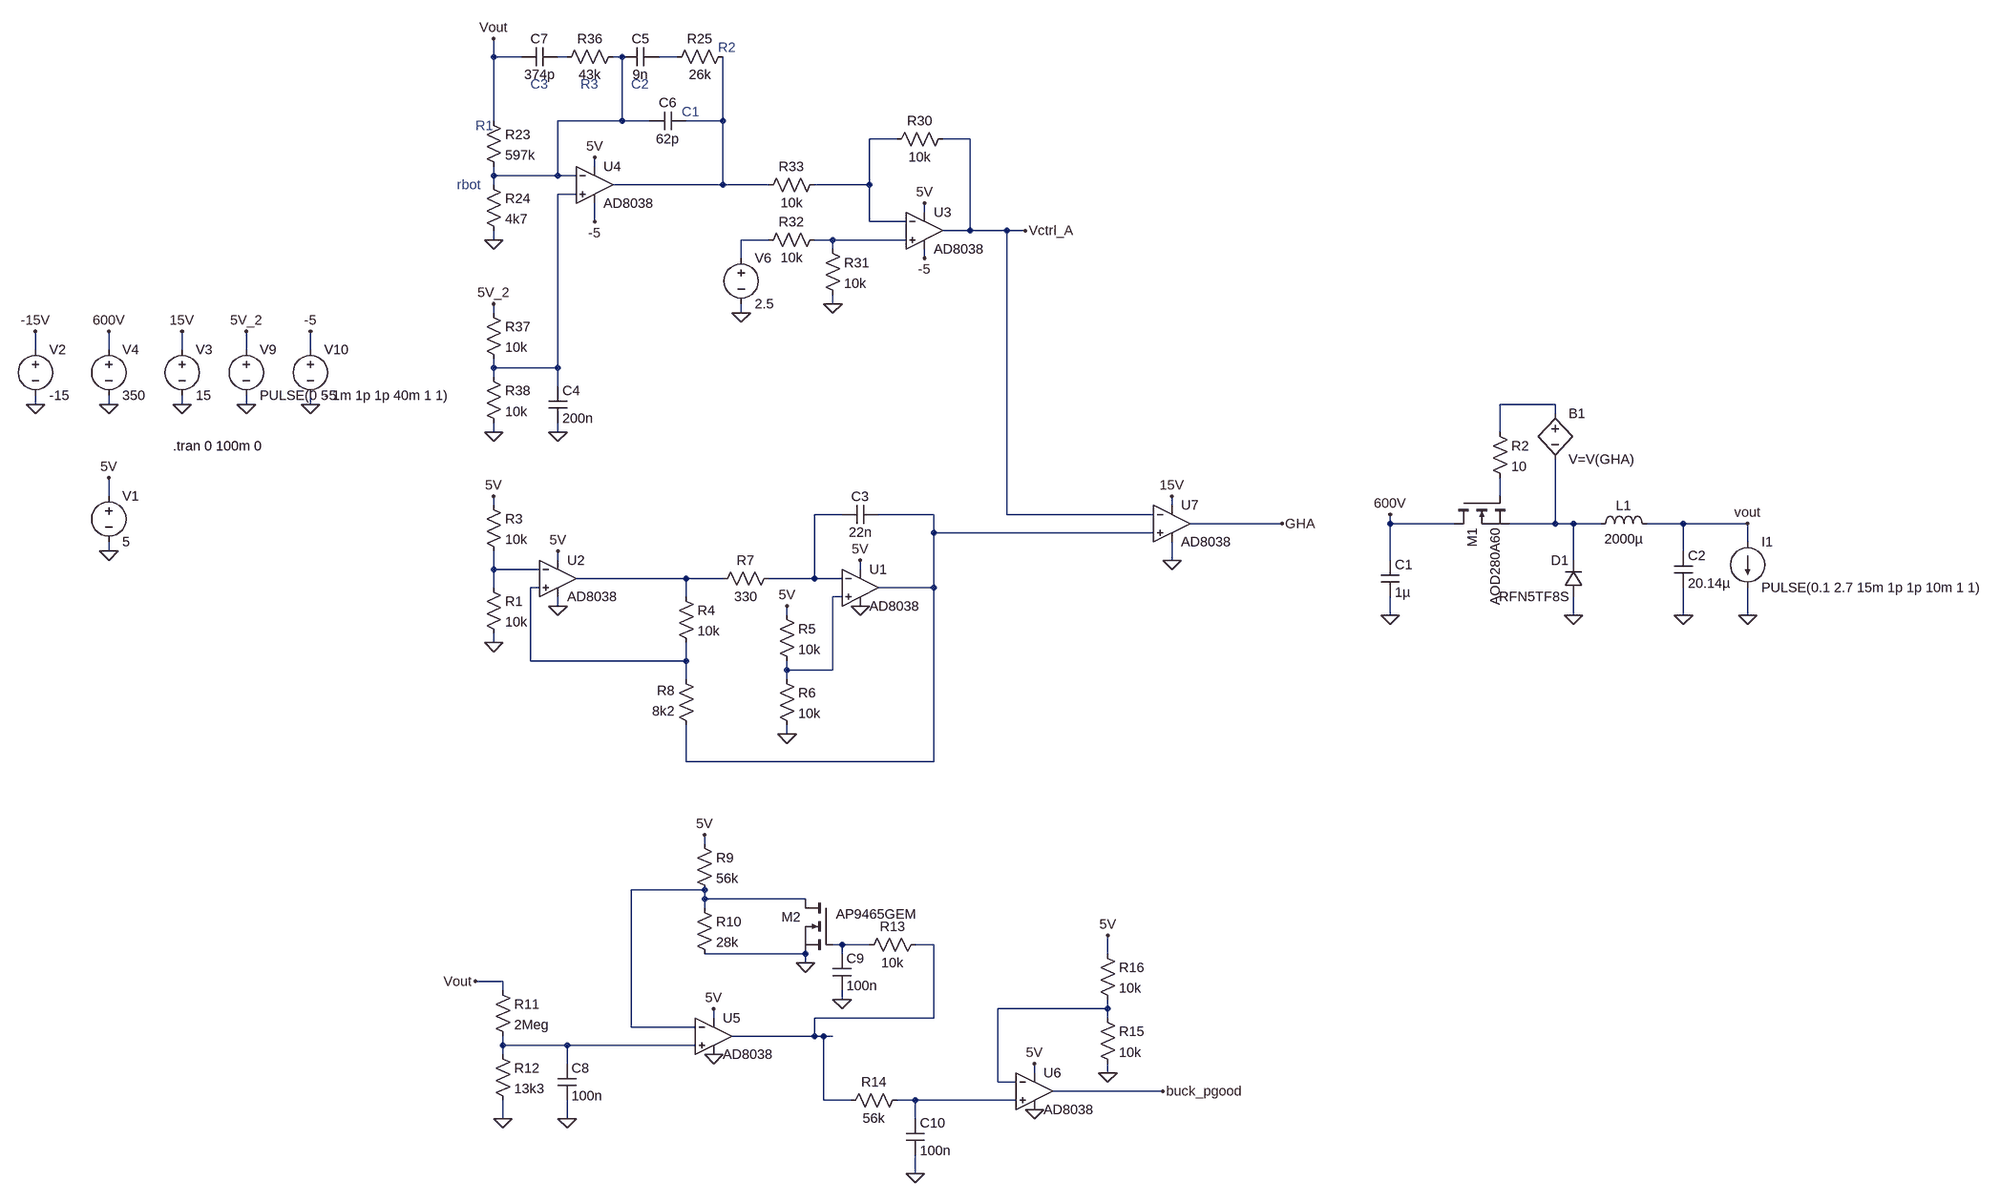
[diagram p0: schematic vicor_buck.asc]
vicor_buck.asc, the LTspice schematic file:
Version 4.1
SHEET 1 4056 680
WIRE -2176 -2112 -2176 -2144
WIRE -2128 -2112 -2176 -2112
WIRE -2048 -2112 -2064 -2112
WIRE -1952 -2112 -1968 -2112
WIRE -1856 -2112 -1888 -2112
WIRE -2176 -2000 -2176 -2112
WIRE -1952 -2000 -1952 -2112
WIRE -1952 -2000 -2064 -2000
WIRE -1904 -2000 -1952 -2000
WIRE -1776 -2000 -1776 -2112
WIRE -1776 -2000 -1840 -2000
WIRE -1472 -1968 -1520 -1968
WIRE -1344 -1968 -1392 -1968
WIRE -2000 -1920 -2000 -1936
WIRE -2176 -1904 -2176 -1920
WIRE -2064 -1904 -2064 -2000
WIRE -2064 -1904 -2176 -1904
WIRE -2032 -1904 -2064 -1904
WIRE -2176 -1888 -2176 -1904
WIRE -1776 -1888 -1776 -2000
WIRE -1776 -1888 -1968 -1888
WIRE -1696 -1888 -1776 -1888
WIRE -1520 -1888 -1520 -1968
WIRE -1520 -1888 -1616 -1888
WIRE -2032 -1872 -2064 -1872
WIRE -1424 -1840 -1424 -1856
WIRE -2000 -1824 -2000 -1856
WIRE -1520 -1824 -1520 -1888
WIRE -1456 -1824 -1520 -1824
WIRE -1344 -1808 -1344 -1968
WIRE -1344 -1808 -1392 -1808
WIRE -1280 -1808 -1344 -1808
WIRE -1248 -1808 -1280 -1808
WIRE -2176 -1792 -2176 -1808
WIRE -1696 -1792 -1744 -1792
WIRE -1584 -1792 -1616 -1792
WIRE -1456 -1792 -1584 -1792
WIRE -1584 -1776 -1584 -1792
WIRE -1744 -1760 -1744 -1792
WIRE -1424 -1760 -1424 -1776
WIRE -1584 -1680 -1584 -1696
WIRE -2176 -1664 -2176 -1680
WIRE -1744 -1664 -1744 -1680
WIRE -2976 -1600 -2976 -1632
WIRE -2848 -1600 -2848 -1632
WIRE -2720 -1600 -2720 -1632
WIRE -2608 -1600 -2608 -1632
WIRE -2496 -1600 -2496 -1632
WIRE -2176 -1568 -2176 -1584
WIRE -2064 -1568 -2064 -1872
WIRE -2064 -1568 -2176 -1568
WIRE -2176 -1552 -2176 -1568
WIRE -2064 -1536 -2064 -1568
WIRE -2976 -1504 -2976 -1520
WIRE -2848 -1504 -2848 -1520
WIRE -2720 -1504 -2720 -1520
WIRE -2608 -1504 -2608 -1520
WIRE -2496 -1504 -2496 -1520
WIRE -288 -1504 -384 -1504
WIRE -288 -1488 -288 -1504
WIRE -2176 -1456 -2176 -1472
WIRE -2064 -1456 -2064 -1472
WIRE -384 -1456 -384 -1504
WIRE -2848 -1344 -2848 -1376
WIRE -384 -1344 -384 -1376
WIRE -2176 -1328 -2176 -1344
WIRE -992 -1328 -992 -1344
WIRE -1568 -1312 -1616 -1312
WIRE -1408 -1312 -1504 -1312
WIRE -1280 -1312 -1280 -1808
WIRE -1024 -1312 -1280 -1312
WIRE -800 -1296 -960 -1296
WIRE -576 -1296 -576 -1312
WIRE -464 -1296 -576 -1296
WIRE -288 -1296 -288 -1408
WIRE -288 -1296 -368 -1296
WIRE -256 -1296 -288 -1296
WIRE -208 -1296 -256 -1296
WIRE -64 -1296 -128 -1296
WIRE 48 -1296 -64 -1296
WIRE -1408 -1280 -1408 -1312
WIRE -1024 -1280 -1408 -1280
WIRE 48 -1264 48 -1296
WIRE -2848 -1248 -2848 -1264
WIRE -64 -1248 -64 -1296
WIRE -2064 -1232 -2064 -1248
WIRE -992 -1232 -992 -1264
WIRE -576 -1232 -576 -1296
WIRE -256 -1232 -256 -1296
WIRE -2176 -1216 -2176 -1248
WIRE -2096 -1216 -2176 -1216
WIRE -1536 -1216 -1536 -1232
WIRE -1840 -1200 -2032 -1200
WIRE -1776 -1200 -1840 -1200
WIRE -1616 -1200 -1616 -1312
WIRE -1616 -1200 -1696 -1200
WIRE -1568 -1200 -1616 -1200
WIRE -2176 -1184 -2176 -1216
WIRE -2096 -1184 -2112 -1184
WIRE -1408 -1184 -1408 -1280
WIRE -1408 -1184 -1504 -1184
WIRE -1840 -1168 -1840 -1200
WIRE -1568 -1168 -1584 -1168
WIRE -2064 -1152 -2064 -1168
WIRE -1664 -1136 -1664 -1152
WIRE -576 -1136 -576 -1168
WIRE -256 -1136 -256 -1168
WIRE -64 -1136 -64 -1184
WIRE 48 -1136 48 -1184
WIRE -2176 -1088 -2176 -1104
WIRE -2112 -1056 -2112 -1184
WIRE -1840 -1056 -1840 -1088
WIRE -1840 -1056 -2112 -1056
WIRE -1664 -1040 -1664 -1056
WIRE -1584 -1040 -1584 -1168
WIRE -1584 -1040 -1664 -1040
WIRE -1840 -1024 -1840 -1056
WIRE -1664 -1024 -1664 -1040
WIRE -1664 -928 -1664 -944
WIRE -1840 -880 -1840 -944
WIRE -1408 -880 -1408 -1184
WIRE -1408 -880 -1840 -880
WIRE -1808 -736 -1808 -752
WIRE -1808 -656 -1936 -656
WIRE -1808 -640 -1808 -656
WIRE -1632 -640 -1808 -640
WIRE -1808 -624 -1808 -640
WIRE -1568 -560 -1584 -560
WIRE -1520 -560 -1568 -560
WIRE -1408 -560 -1440 -560
WIRE -1632 -544 -1808 -544
WIRE -1568 -544 -1568 -560
WIRE -1104 -544 -1104 -576
WIRE -1632 -528 -1632 -544
WIRE -2160 -496 -2208 -496
WIRE -2160 -480 -2160 -496
WIRE -1568 -464 -1568 -480
WIRE -1104 -448 -1104 -464
WIRE -1104 -448 -1296 -448
WIRE -1792 -432 -1792 -448
WIRE -1408 -432 -1408 -560
WIRE -1408 -432 -1616 -432
WIRE -1104 -432 -1104 -448
WIRE -1936 -416 -1936 -656
WIRE -1824 -416 -1936 -416
WIRE -1616 -400 -1616 -432
WIRE -1616 -400 -1760 -400
WIRE -1600 -400 -1616 -400
WIRE -1584 -400 -1600 -400
WIRE -2160 -384 -2160 -400
WIRE -2048 -384 -2160 -384
WIRE -1824 -384 -2048 -384
WIRE -2160 -368 -2160 -384
WIRE -2048 -352 -2048 -384
WIRE -1232 -336 -1232 -352
WIRE -1104 -336 -1104 -352
WIRE -1296 -320 -1296 -448
WIRE -1264 -320 -1296 -320
WIRE -1008 -304 -1200 -304
WIRE -1600 -288 -1600 -400
WIRE -1552 -288 -1600 -288
WIRE -1440 -288 -1472 -288
WIRE -1264 -288 -1440 -288
WIRE -2160 -256 -2160 -288
WIRE -2048 -256 -2048 -288
WIRE -1440 -256 -1440 -288
WIRE -1440 -160 -1440 -192
FLAG -576 -1312 600V
FLAG -64 -1136 0
FLAG -256 -1136 0
FLAG 48 -1136 0
FLAG -576 -1136 0
FLAG 48 -1296 vout
FLAG -2720 -1504 0
FLAG -2720 -1632 15V
FLAG -2064 -1152 0
FLAG -2176 -1088 0
FLAG -1664 -928 0
FLAG -1536 -1152 0
FLAG -992 -1232 0
FLAG -800 -1296 GHA
FLAG -2848 -1632 600V
FLAG -2176 -1792 0
FLAG -2176 -2144 Vout
FLAG -1584 -1680 0
FLAG -1744 -1664 0
FLAG -1248 -1808 Vctrl_A
FLAG -2608 -1504 0
FLAG -2608 -1632 5V_2
FLAG -2176 -1344 5V
FLAG -2064 -1248 5V
FLAG -1664 -1152 5V
FLAG -1536 -1232 5V
FLAG -2496 -1504 0
FLAG -2496 -1632 -5
FLAG -2176 -1456 0
FLAG -2176 -1680 5V_2
FLAG -992 -1344 15V
FLAG -2848 -1504 0
FLAG -2064 -1456 0
FLAG -2848 -1248 0
FLAG -2848 -1376 5V
FLAG -2976 -1504 0
FLAG -2976 -1632 -15V
FLAG -2000 -1936 5V
FLAG -1424 -1856 5V
FLAG -2000 -1824 -5
FLAG -1424 -1760 -5
FLAG -1792 -368 0
FLAG -1792 -448 5V
FLAG -2048 -256 0
FLAG -1632 -528 0
FLAG -1808 -752 5V
FLAG -2160 -256 0
FLAG -1568 -464 0
FLAG -1232 -272 0
FLAG -1232 -352 5V
FLAG -1440 -160 0
FLAG -1104 -336 0
FLAG -1104 -576 5V
FLAG -1008 -304 buck_pgood
FLAG -2208 -496 Vout
SYMBOL nmos -464 -1344 M90
SYMATTR InstName M1
SYMATTR Value AOD280A60
SYMBOL cap -592 -1232 R0
SYMATTR InstName C1
SYMATTR Value 1µ
SYMBOL diode -240 -1168 R180
WINDOW 0 24 64 Left 2
WINDOW 3 24 0 Left 2
SYMATTR InstName D1
SYMATTR Value RFN5TF8S
SYMBOL ind -224 -1280 R270
WINDOW 0 32 56 VTop 2
WINDOW 3 5 56 VBottom 2
SYMATTR InstName L1
SYMATTR Value 2000µ
SYMATTR SpiceLine Rser=1.2
SYMBOL cap -80 -1248 R0
SYMATTR InstName C2
SYMATTR Value 20.14µ
SYMATTR SpiceLine Rser=515u
SYMBOL res -400 -1472 R0
SYMATTR InstName R2
SYMATTR Value 10
SYMBOL voltage -2720 -1616 R0
WINDOW 123 0 0 Left 0
WINDOW 39 0 0 Left 0
SYMATTR InstName V3
SYMATTR Value 15
SYMBOL res -2192 -1200 R0
SYMATTR InstName R1
SYMATTR Value 10k
SYMBOL res -2192 -1344 R0
SYMATTR InstName R3
SYMATTR Value 10k
SYMBOL res -1856 -1184 R0
SYMATTR InstName R4
SYMATTR Value 10k
SYMBOL res -1680 -1152 R0
SYMATTR InstName R5
SYMATTR Value 10k
SYMBOL res -1680 -1040 R0
SYMATTR InstName R6
SYMATTR Value 10k
SYMBOL res -1680 -1216 R90
WINDOW 0 0 56 VBottom 2
WINDOW 3 32 56 VTop 2
SYMATTR InstName R7
SYMATTR Value 330
SYMBOL res -1824 -928 R180
WINDOW 0 36 76 Left 2
WINDOW 3 36 40 Left 2
SYMATTR InstName R8
SYMATTR Value 8k2
SYMBOL cap -1504 -1328 R90
WINDOW 0 0 32 VBottom 2
WINDOW 3 32 32 VTop 2
SYMATTR InstName C3
SYMATTR Value 22n
SYMBOL voltage -2848 -1616 R0
WINDOW 123 0 0 Left 0
WINDOW 39 0 0 Left 0
SYMATTR InstName V4
SYMATTR Value 350
SYMBOL bv -288 -1504 R0
SYMATTR InstName B1
SYMATTR Value V=V(GHA)
SYMBOL res -2192 -2016 R0
SYMATTR InstName R23
SYMATTR Value 597k
SYMBOL res -2192 -1904 R0
SYMATTR InstName R24
SYMATTR Value 4k7
SYMBOL cap -1888 -2128 R90
WINDOW 0 0 32 VBottom 2
WINDOW 3 32 32 VTop 2
SYMATTR InstName C5
SYMATTR Value 9n
SYMBOL cap -1840 -2016 R90
WINDOW 0 0 32 VBottom 2
WINDOW 3 32 32 VTop 2
SYMATTR InstName C6
SYMATTR Value 62p
SYMBOL res -1760 -2128 R90
WINDOW 0 0 56 VBottom 2
WINDOW 3 32 56 VTop 2
SYMATTR InstName R25
SYMATTR Value 26k
SYMBOL res -1376 -1984 R90
WINDOW 0 0 56 VBottom 2
WINDOW 3 32 56 VTop 2
SYMATTR InstName R30
SYMATTR Value 10k
SYMBOL res -1600 -1792 R0
SYMATTR InstName R31
SYMATTR Value 10k
SYMBOL res -1600 -1808 R90
WINDOW 0 0 56 VBottom 2
WINDOW 3 32 56 VTop 2
SYMATTR InstName R32
SYMATTR Value 10k
SYMBOL res -1600 -1904 R90
WINDOW 0 0 56 VBottom 2
WINDOW 3 32 56 VTop 2
SYMATTR InstName R33
SYMATTR Value 10k
SYMBOL voltage -1744 -1776 R0
WINDOW 123 0 0 Left 0
WINDOW 39 0 0 Left 0
SYMATTR InstName V6
SYMATTR Value 2.5
SYMBOL res -1952 -2128 R90
WINDOW 0 0 56 VBottom 2
WINDOW 3 32 56 VTop 2
SYMATTR InstName R36
SYMATTR Value 43k
SYMBOL cap -2064 -2128 R90
WINDOW 0 0 32 VBottom 2
WINDOW 3 32 32 VTop 2
SYMATTR InstName C7
SYMATTR Value 374p
SYMBOL voltage -2608 -1616 R0
WINDOW 123 0 0 Left 0
WINDOW 39 0 0 Left 0
SYMATTR InstName V9
SYMATTR Value PULSE(0 5 1m 1p 1p 40m 1 1)
SYMBOL voltage -2496 -1616 R0
WINDOW 123 0 0 Left 0
WINDOW 39 0 0 Left 0
SYMATTR InstName V10
SYMATTR Value -5
SYMBOL res -2192 -1680 R0
SYMATTR InstName R37
SYMATTR Value 10k
SYMBOL res -2192 -1568 R0
SYMATTR InstName R38
SYMATTR Value 10k
SYMBOL cap -2080 -1536 R0
SYMATTR InstName C4
SYMATTR Value 200n
SYMBOL voltage -2848 -1360 R0
WINDOW 123 0 0 Left 0
WINDOW 39 0 0 Left 0
SYMATTR InstName V1
SYMATTR Value 5
SYMBOL OpAmps\\AD8038 -992 -1360 R0
SYMATTR InstName U7
SYMBOL OpAmps\\AD8038 -1536 -1248 R0
SYMATTR InstName U1
SYMBOL OpAmps\\AD8038 -2064 -1264 R0
SYMATTR InstName U2
SYMBOL OpAmps\\AD8038 -1424 -1872 R0
SYMATTR InstName U3
SYMBOL OpAmps\\AD8038 -2000 -1952 R0
SYMATTR InstName U4
SYMBOL voltage -2976 -1616 R0
WINDOW 123 0 0 Left 0
WINDOW 39 0 0 Left 0
SYMATTR InstName V2
SYMATTR Value -15
SYMBOL current 48 -1264 R0
WINDOW 123 0 0 Left 0
WINDOW 39 0 0 Left 0
SYMATTR InstName I1
SYMATTR Value PULSE(0.1 2.7 15m 1p 1p 10m 1 1)
SYMBOL OpAmps\\AD8038 -1792 -464 R0
SYMATTR InstName U5
SYMBOL cap -2064 -352 R0
SYMATTR InstName C8
SYMATTR Value 100n
SYMBOL res -1824 -752 R0
SYMATTR InstName R9
SYMATTR Value 56k
SYMBOL res -1824 -640 R0
SYMATTR InstName R10
SYMATTR Value 28k
SYMBOL nmos -1584 -640 M0
WINDOW 3 -146 27 Left 2
SYMATTR InstName M2
SYMATTR Value AP9465GEM
SYMBOL res -2176 -496 R0
SYMATTR InstName R11
SYMATTR Value 2Meg
SYMBOL res -2176 -384 R0
SYMATTR InstName R12
SYMATTR Value 13k3
SYMBOL res -1424 -576 R90
WINDOW 0 0 56 VBottom 2
WINDOW 3 32 56 VTop 2
SYMATTR InstName R13
SYMATTR Value 10k
SYMBOL cap -1584 -544 R0
SYMATTR InstName C9
SYMATTR Value 100n
SYMBOL OpAmps\\AD8038 -1232 -368 R0
SYMATTR InstName U6
SYMBOL res -1456 -304 R90
WINDOW 0 0 56 VBottom 2
WINDOW 3 32 56 VTop 2
SYMATTR InstName R14
SYMATTR Value 56k
SYMBOL cap -1456 -256 R0
SYMATTR InstName C10
SYMATTR Value 100n
SYMBOL res -1120 -448 R0
SYMATTR InstName R15
SYMATTR Value 10k
SYMBOL res -1120 -560 R0
SYMATTR InstName R16
SYMATTR Value 10k
TEXT -2736 -1432 Left 2 !.tran 0 100m 0
TEXT -1848 -2016 Left 2 ;C1
TEXT -1936 -2064 Left 2 ;C2
TEXT -2024 -2064 Left 2 ;R3
TEXT -2112 -2064 Left 2 ;C3
TEXT -1784 -2128 Left 2 ;R2
TEXT -2208 -1992 Left 2 ;R1
TEXT -2240 -1888 Left 2 ;rbot

The netlist it stands for:
* vicor_buck.asc
M1 600V N010 N013 N013 AOD280A60
C1 600V 0 1µ
D1 0 N013 RFN5TF8S
L1 N013 vout 2000µ Rser=1.2
C2 vout 0 20.14µ Rser=515u
R2 N009 N010 10
V3 15V 0 15
R1 N014 0 10k
R3 5V N014 10k
R4 N015 N016 10k
R5 5V N017 10k
R6 N017 0 10k
R7 N011 N015 330
R8 N012 N016 8k2
C3 N012 N011 22n
V4 600V 0 350
B1 N009 N013 V=V(GHA)
R23 vout N002 597k
R24 N002 0 4k7
C5 N003 N002 9n
C6 N004 N002 62p
R25 N004 N003 26k
R30 Vctrl_A N005 10k
R31 N008 0 10k
R32 N008 N007 10k
R33 N005 N004 10k
V6 N007 0 2.5
R36 N002 N001 43k
C7 N001 vout 374p
V9 5V_2 0 PULSE(0 5 1m 1p 1p 40m 1 1)
V10 -5 0 -5
R37 5V_2 N006 10k
R38 N006 0 10k
C4 N006 0 200n
V1 5V 0 5
X§U7 N012 Vctrl_A 15V 0 GHA AD8038  ; pins In+ In- V+ V- OUT
X§U1 N017 N011 5V 0 N012 AD8038  ; pins In+ In- V+ V- OUT
X§U2 N016 N014 5V 0 N015 AD8038  ; pins In+ In- V+ V- OUT
X§U3 N008 N005 5V -5 Vctrl_A AD8038  ; pins In+ In- V+ V- OUT
X§U4 N006 N002 5V -5 N004 AD8038  ; pins In+ In- V+ V- OUT
V2 -15V 0 -15
I1 vout 0 PULSE(0.1 2.7 15m 1p 1p 10m 1 1)
X§U5 N022 N018 5V 0 N020 AD8038  ; pins In+ In- V+ V- OUT
C8 N022 0 100n
R9 5V N018 56k
R10 N018 0 28k
M2 N018 N019 0 0 AP9465GEM
R11 vout N022 2Meg
R12 N022 0 13k3
R13 N020 N019 10k
C9 N019 0 100n
X§U6 N023 N021 5V 0 buck_pgood AD8038  ; pins In+ In- V+ V- OUT
R14 N023 N020 56k
C10 N023 0 100n
R15 N021 0 10k
R16 5V N021 10k
.model D D
.lib standard.dio
.model NMOS NMOS
.model PMOS PMOS
.lib standard.mos
.tran 0 100m 0
* C1
* C2
* R3
* C3
* R2
* R1
* rbot
.backanno
.end